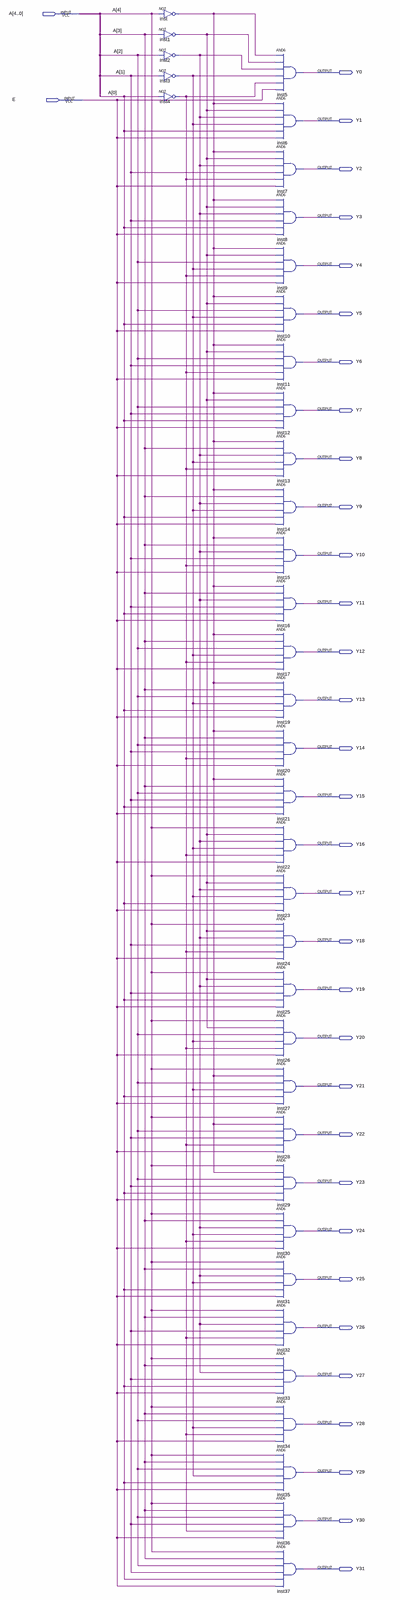
[diagram p0: schematic sheet, whole]
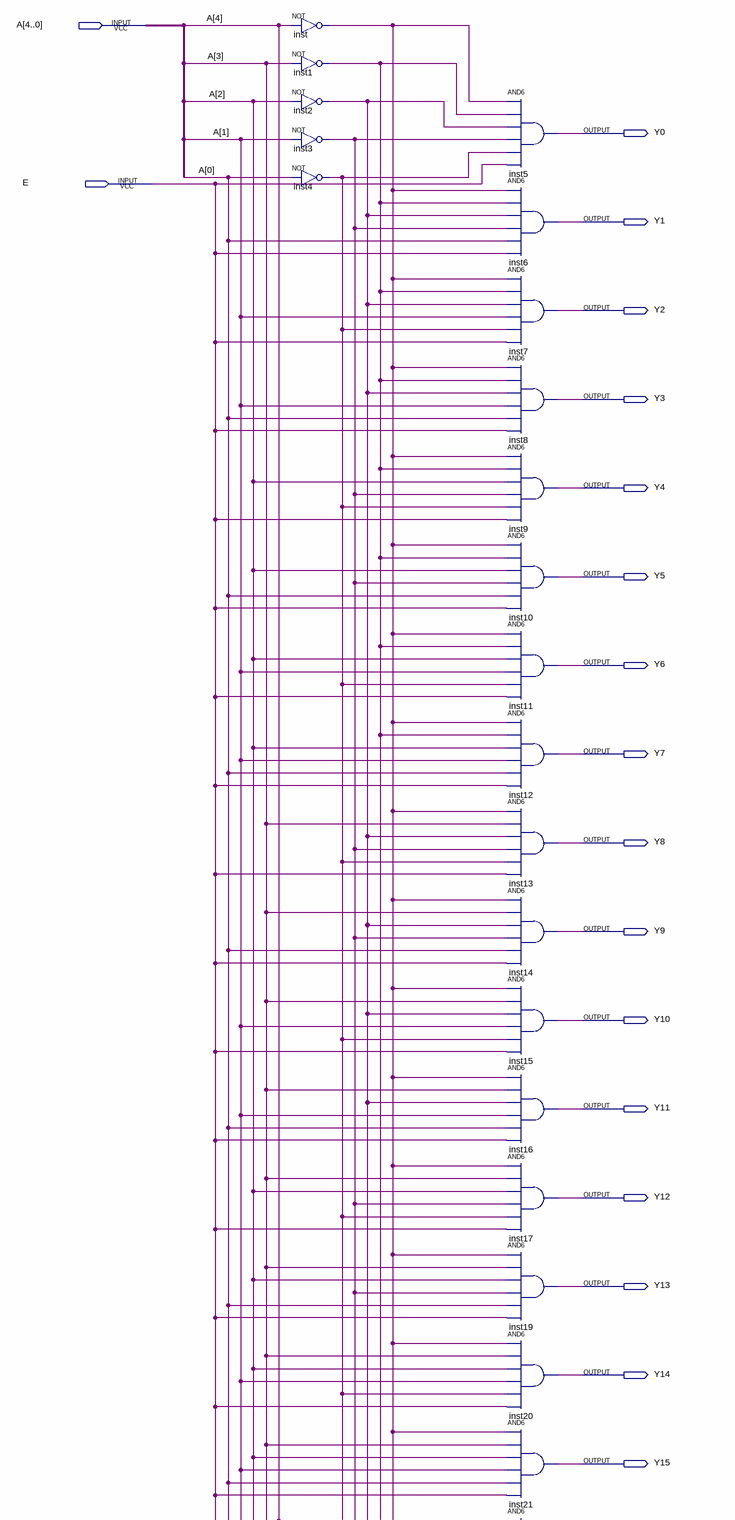
[diagram p1: schematic sheet, upper part]
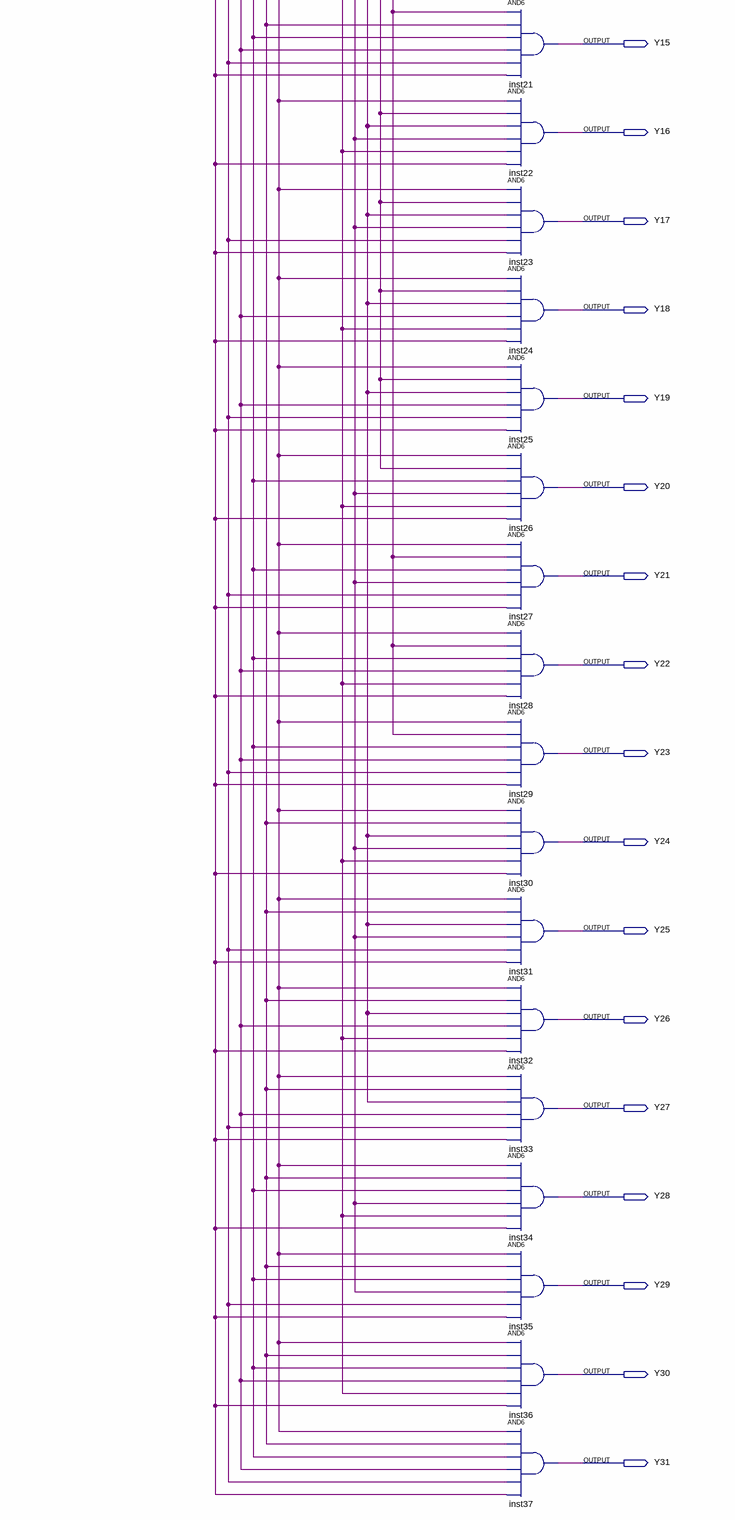
[diagram p2: schematic sheet, lower part]
// Quartus schematic decoder532e.bdf as structural Verilog: 37 symbols, 34 pins
module decoder532e (
  input  [4:0] A,
  input  E,
  output Y0,
  output Y1,
  output Y2,
  output Y3,
  output Y4,
  output Y5,
  output Y6,
  output Y7,
  output Y8,
  output Y9,
  output Y10,
  output Y11,
  output Y12,
  output Y13,
  output Y14,
  output Y15,
  output Y16,
  output Y17,
  output Y18,
  output Y19,
  output Y20,
  output Y21,
  output Y22,
  output Y23,
  output Y24,
  output Y25,
  output Y26,
  output Y27,
  output Y28,
  output Y29,
  output Y30,
  output Y31
);

  wire inst1_out, inst2_out, inst3_out, inst4_out, inst_out;

  not inst (inst_out, A[4]);
  not inst1 (inst1_out, A[3]);
  not inst2 (inst2_out, A[2]);
  not inst3 (inst3_out, A[1]);
  not inst4 (inst4_out, A[0]);
  and inst5 (Y0, inst_out, inst1_out, inst2_out, inst3_out, inst4_out, E);
  and inst6 (Y1, inst_out, inst1_out, inst2_out, inst3_out, A[0], E);
  and inst7 (Y2, inst_out, inst1_out, inst2_out, A[1], inst4_out, E);
  and inst8 (Y3, inst_out, inst1_out, inst2_out, A[1], A[0], E);
  and inst9 (Y4, inst_out, inst1_out, A[2], inst3_out, inst4_out, E);
  and inst10 (Y5, inst_out, inst1_out, A[2], inst3_out, A[0], E);
  and inst11 (Y6, inst_out, inst1_out, A[2], A[1], inst4_out, E);
  and inst12 (Y7, inst_out, inst1_out, A[2], A[1], A[0], E);
  and inst13 (Y8, inst_out, A[3], inst2_out, inst3_out, inst4_out, E);
  and inst14 (Y9, inst_out, A[3], inst2_out, inst3_out, A[0], E);
  and inst15 (Y10, inst_out, A[3], inst2_out, A[1], inst4_out, E);
  and inst16 (Y11, inst_out, A[3], inst2_out, A[1], A[0], E);
  and inst17 (Y12, inst_out, A[3], A[2], inst3_out, inst4_out, E);
  and inst19 (Y13, inst_out, A[3], A[2], inst3_out, A[0], E);
  and inst20 (Y14, inst_out, A[3], A[2], A[1], inst4_out, E);
  and inst21 (Y15, inst_out, A[3], A[2], A[1], A[0], E);
  and inst22 (Y16, A[4], inst1_out, inst2_out, inst3_out, inst4_out, E);
  and inst23 (Y17, A[4], inst1_out, inst2_out, inst3_out, A[0], E);
  and inst24 (Y18, A[4], inst1_out, inst2_out, A[1], inst4_out, E);
  and inst25 (Y19, A[4], inst1_out, inst2_out, A[1], A[0], E);
  and inst26 (Y20, A[4], inst1_out, A[2], inst3_out, inst4_out, E);
  and inst27 (Y21, A[4], inst_out, A[2], inst3_out, A[0], E);
  and inst28 (Y22, A[4], inst_out, A[2], A[1], inst4_out, E);
  and inst29 (Y23, A[4], inst_out, A[2], A[1], A[0], E);
  and inst30 (Y24, A[4], A[3], inst2_out, inst3_out, inst4_out, E);
  and inst31 (Y25, A[4], A[3], inst2_out, inst3_out, A[0], E);
  and inst32 (Y26, A[4], A[3], inst2_out, A[1], inst4_out, E);
  and inst33 (Y27, A[4], A[3], inst2_out, A[1], A[0], E);
  and inst34 (Y28, A[4], A[3], A[2], inst3_out, inst4_out, E);
  and inst35 (Y29, A[4], A[3], A[2], inst3_out, A[0], E);
  and inst36 (Y30, A[4], A[3], A[2], A[1], inst4_out, E);
  and inst37 (Y31, A[4], A[3], A[2], A[1], A[0], E);
endmodule
